# EAGLE design senseBox-CAM-M8Q_v21 (EAGLE 7.7.0)
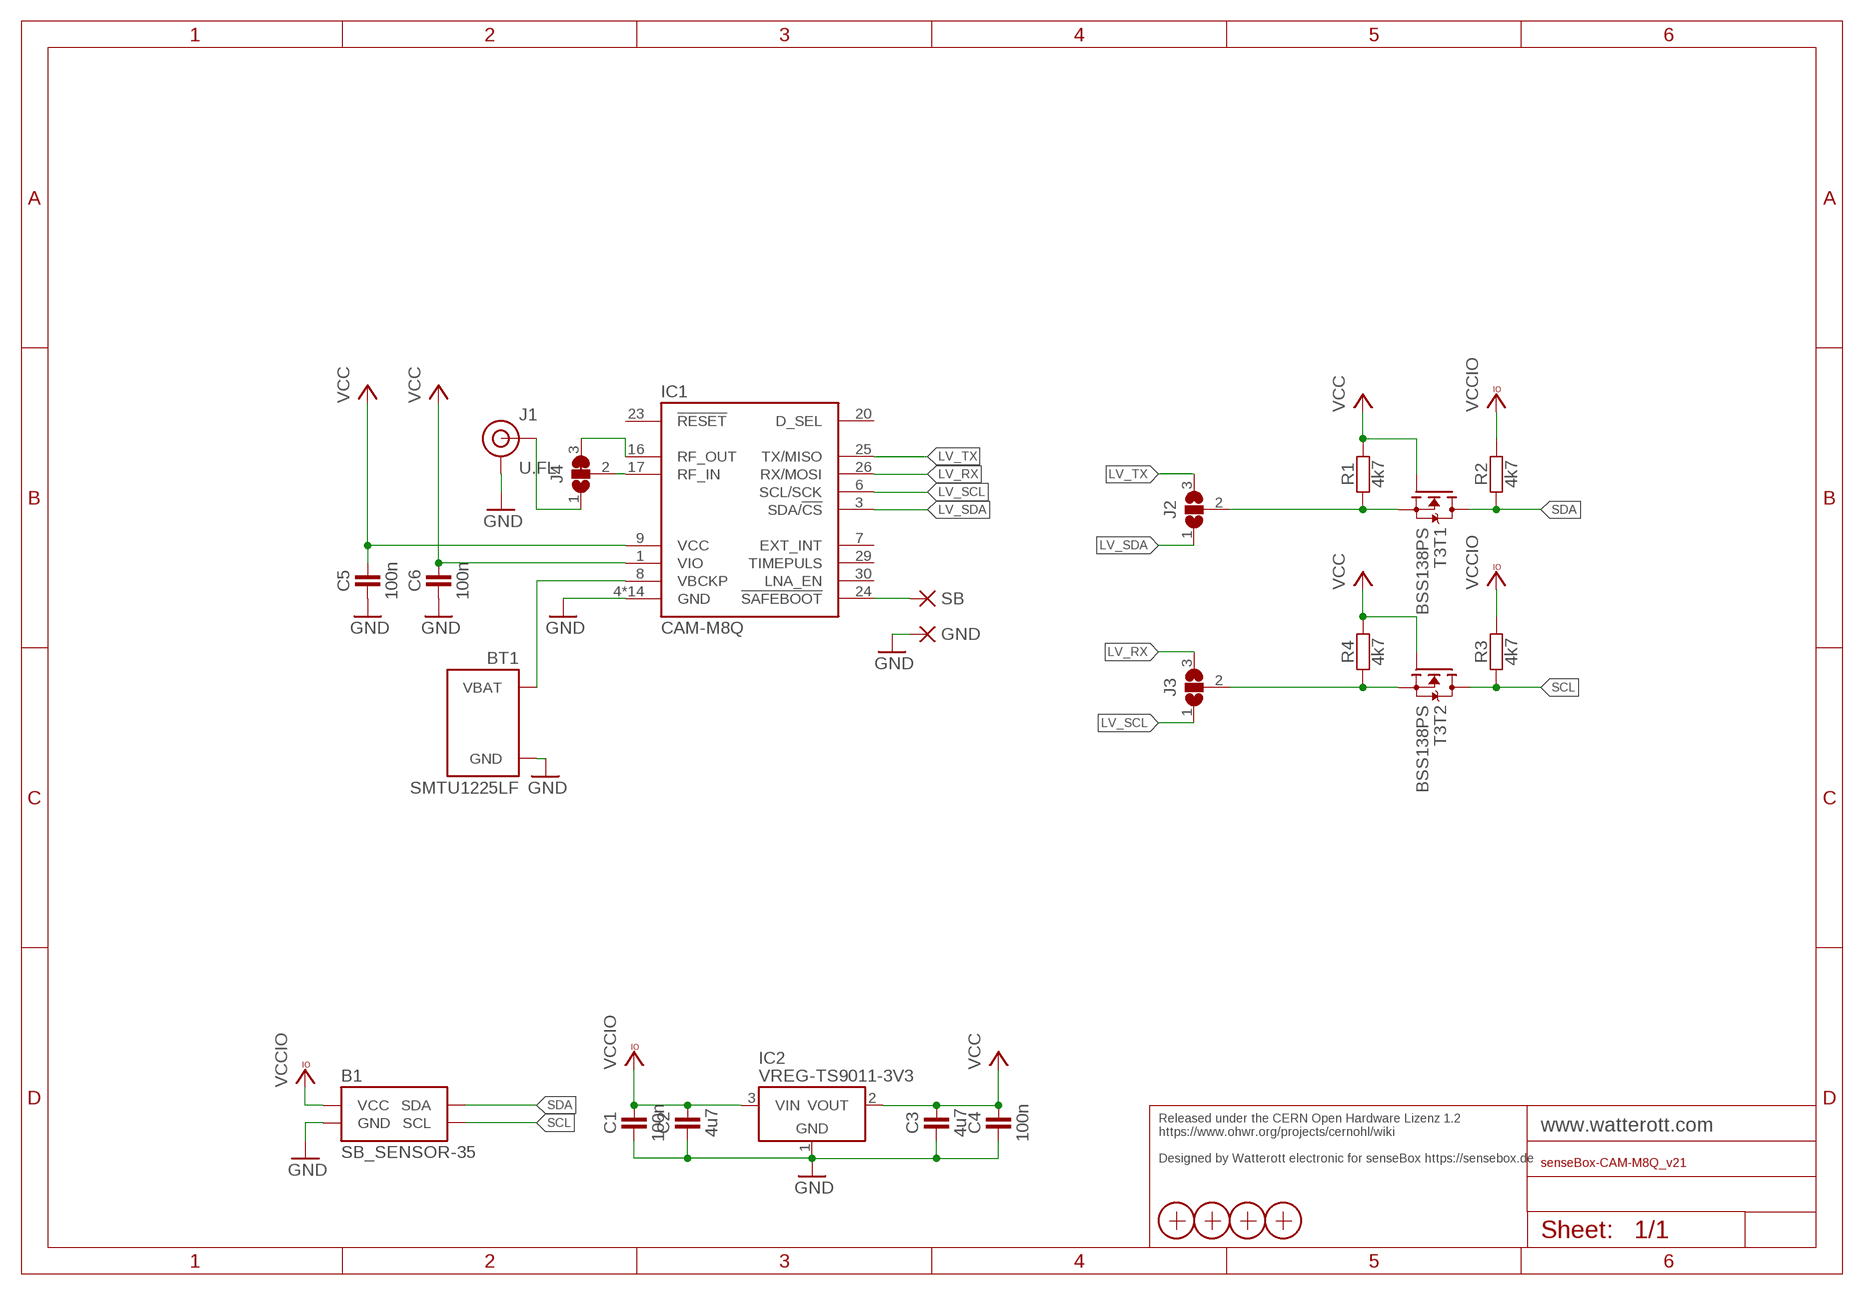
[diagram p0: schematic, sheet 1]

## Parts
B1  SB_SENSOR-35  [SB-35X25]
BT1  SMTU1225LF  BATTERY-SMTU1225LF  [BAT-SMTU1225LF]
C1  100n  CAPACITOR-0402  [C0402]
C2  4u7  CAPACITOR-0402  [C0402]
C3  4u7  CAPACITOR-0402  [C0402]
C4  100n  CAPACITOR-0402  [C0402]
C5  100n  CAPACITOR-0402  [C0402]
C6  100n  CAPACITOR-0402  [C0402]
GND  PAD-1.27X1.27_NC  [PAD-1.27X1.27_NC]
IC1  CAM-M8Q  [CAM-M8Q]
IC2  VREG-TS9011-3V3  [SOT23]
J1  U.FL  [U.FL]
J2  JUMPER3-0603-NC  [JUMPER3-0603_NC]
J3  JUMPER3-0603-NC  [JUMPER3-0603_NC]
J4  JUMPER3-0603  [JUMPER3-0603]
R1  4k7  RESISTOR-0402  [C0402]
R2  4k7  RESISTOR-0402  [C0402]
R3  4k7  RESISTOR-0402  [C0402]
R4  4k7  RESISTOR-0402  [C0402]
SB  PAD-1.27X1.27_NC  [PAD-1.27X1.27_NC]
T3  BSS138PS  [SOT363]
X1  PASSER-07  [PASSER_07MM]
X2  PASSER-07  [PASSER_07MM]
X3  PASSER-07  [PASSER_07MM]
X4  PASSER-07  [PASSER_07MM]

## Nets
GND: B1.GND BT1.-(GND) C1.1 C2.1 C3.1 C4.1 C5.1 C6.1 GND.1(P) IC1.4(GND) IC1.5(GND) IC1.10(GND) IC1.11(GND) IC1.12(GND) IC1.13(GND) IC1.14(GND) IC1.15(GND) IC1.18(GND) IC1.19(GND) IC1.21(GND) IC1.22(GND) IC1.27(GND) IC1.31(GND) IC2.1(GND) J1.1(GND) J1.2(GND)
LV_RX: IC1.26(RX/MOSI) J3.3
LV_SCL: IC1.6(SCL/SCK) J3.1
LV_SDA: IC1.3(SDA/!CS) J2.1
LV_TX: IC1.25(TX/MISO) J2.3
N$3: J2.2 R1.1 T3.1(T1:S)
N$4: J3.2 R4.1 T3.4(T2:S)
N$7: J1.FEED(SIGNAL) J4.1
RFIN: IC1.17(RF_IN) J4.2
RFOUT: IC1.16(RF_OUT) J4.3
SB: IC1.24(!SAFEBOOT) SB.1(P)
SCL: B1.SCL R3.1 T3.3(T2:D)
SDA: B1.SDA R2.1 T3.6(T1:D)
VBAT: BT1.+(VBAT) IC1.8(VBCKP)
VCC: C3.2 C4.2 C5.2 C6.2 IC1.1(VIO) IC1.9(VCC) IC2.2(VOUT) R1.2 R4.2 T3.2(T1:G) T3.5(T2:G)
VCCIO: B1.VCC C1.2 C2.2 IC2.3(VIN) R2.2 R3.2
Unconnected: IC1.7(EXT_INT) IC1.20(D_SEL) IC1.23(!RESET) IC1.29(TIMEPULS) IC1.30(LNA_EN)

## Notes on the sheet
- Released under the CERN Open Hardware Lizenz 1.2
  https://www.ohwr.org/projects/cernohl/wiki
  
  Designed by Watterott electronic for senseBox https://sensebox.de

## Library data of the parts
B1 = we-board:SB_SENSOR: SenseBox Sensors/Breakouts
BT1 = we-power:BATTERY: Battery Holder
C1-C6 = we-rcl:CAPACITOR: Capacitors ...2.2uF @ 6.3V -> 0402 ...4.7uF @ 6.3V -> 0603 ...10uF @ 16V -> 0805 ...22uF @ 25V -> 1206
GND SB = we-rcl:PAD: Pads and Test-Points
IC1 = we-sensor:CAM-M8Q: u-blox CAM-M8Q Multi-GNSS-Module (GPS, QZSS, GLONASS, Galileo, BeiDou)
IC2 = we-power:VREG: Voltage Regulators (LDOs, Switching Converters...) LDOs Taiwan Semi TS1117 800mA max 15V - compatible On Semi NCP1117 1A max 20V - compatible Diodes AP2111H 0.6A max 6V (0.25V@0.6A) - compatible Diodes AP2114H 1A max 6V (0.45V@1A) Taiwan Semi TS9011 250mA max 12V - compatible Diodes AP2210 300mA max 15V - compatible Microchip MCP1700 250mA max 6.5V - compatible Microchip MCP1702 250mA max 13V - compatible Microchip MCP1703 250mA max 16V - compatible Microchip MCP1754 150mA max 16V Taiwan Semi TS5204 150mA max 16V (low noise) DC/DC Converter Modules Recom R-78Ex.x-1.0-W36 1A max 28V - compatible CUI V78xx-2000 2A max 18V Murata OKI-78SR-x.x/1.5-W36 1.5A max 36V
J1 = we-con:U.FL: U.FL Connector
J2-J4 = we-rcl:JUMPER3: 3 Pin Jumpers
R1-R4 = we-rcl:RESISTOR: Resistors all kinds in 0402 and 0603
T3 = we-transistor:BSS138PS: Dual N-Channel MOSFET BSS138 (Vgs>=+/-20V, Vds>=40V, Id>=0.2A + Rds<=3Ohm @ Vgs=4.5V)
X1-X4 = we-symbol:PASSER: Fiducial Markers

## Board
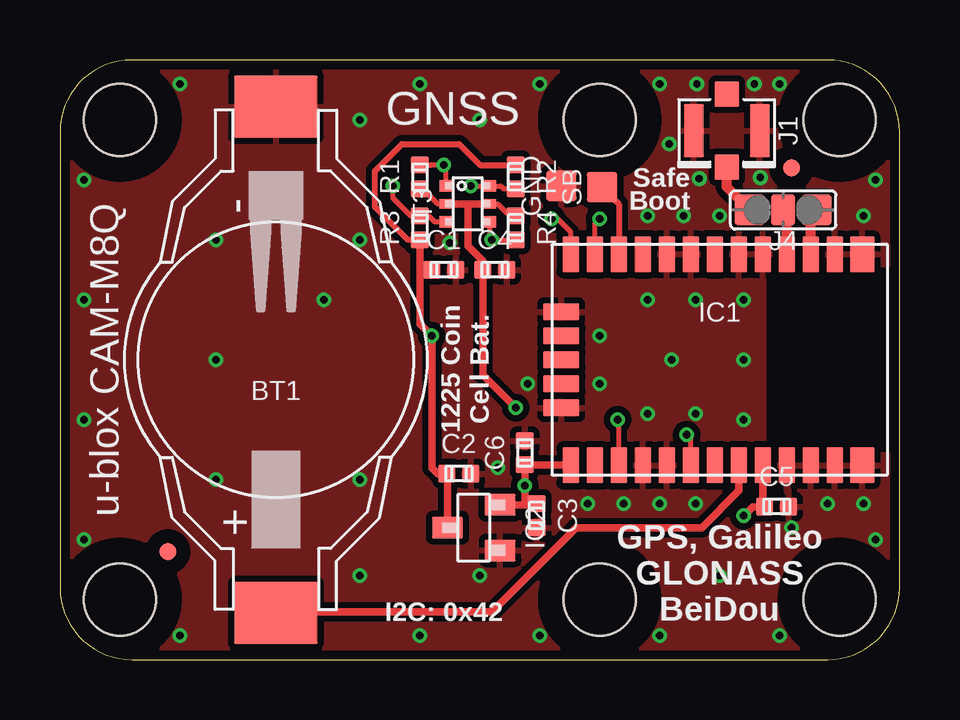
[diagram p1: board, top side]
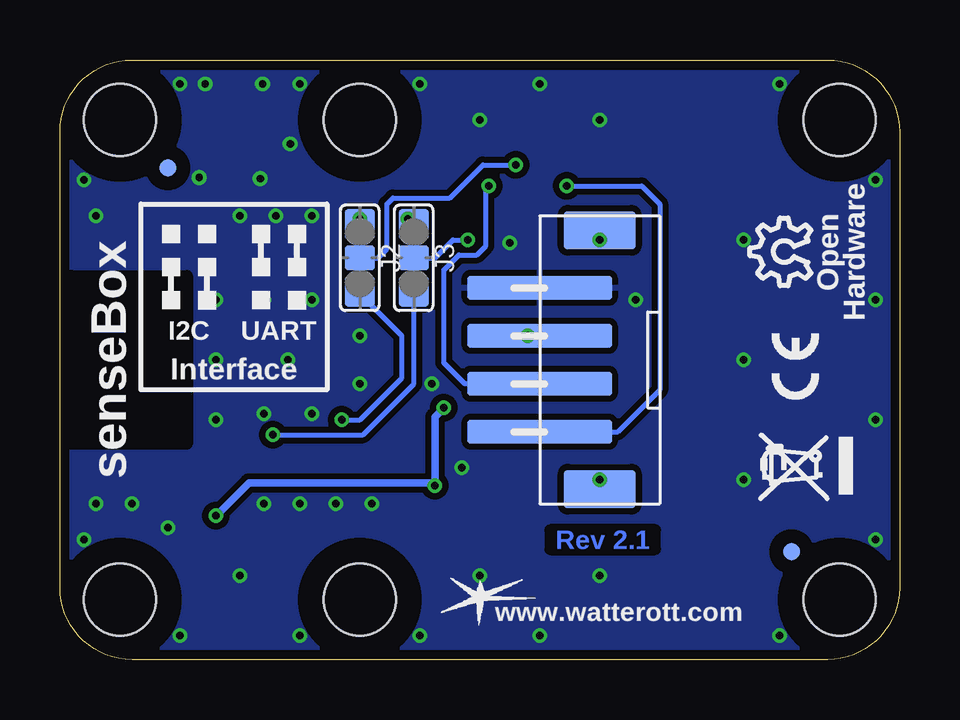
[diagram p2: board, bottom side, seen from below]

Size 35 x 25 mm. Coordinates in mm from the lower left corner, seen from the top.
Copper layers (1*16): Top 0.035mm / dielectric 1.5mm / Bottom 0.035mm
Design rules "we-dru-2-layer": minimum track width 0.15mm, minimum drill 0.3mm, track to track 0.15mm, track to pad 0.15mm, pad to pad 0.15mm, via to via 0.15mm, smd to smd 0.1mm, copper to edge 0.4mm, drill to drill 0.2mm, minimum pad ring 0.18mm, minimum via ring 0.16mm, stop-mask expansion 0.1mm, vias tented up to drill 0.5mm, thermal gap 0.25mm

### Footprints (pad centres in the part's own frame; a part is rotated, then mirrored left to right if it is on the bottom)
SB-35X25 = smd 6 x 1 bottom: GND 15,15.5; SCL 15,9.5; SDA 15,11.5; VCC 15,13.5 | smd 3 x 1.6 bottom: SHLD1 12.5,17.9; SHLD2 12.5,7.1 | hole 3: 2.5,22.5; 2.5,2.5; 22.5,22.5; 22.5,2.5; 32.5,22.5; 32.5,2.5
BAT-SMTU1225LF = smd 3.5 x 2.6: + 0,10.55; - 0,-10.55
C0402 = smd 0.75 x 0.7: 1 0,0.5; 2 0,-0.5
PAD-1.27X1.27_NC = smd 1.27 x 1.27: 1 0,0
CAM-M8Q = smd 0.7 x 1.5: 1 -6.2,-4.4; 2 -5.2,-4.4; 3 -4.2,-4.4; 4 -3.2,-4.4; 5 -2.2,-4.4; 6 -1.2,-4.4; 7 -0.2,-4.4; 8 0.8,-4.4; 9 1.8,-4.4; 10 2.8,-4.4; 11 3.8,-4.4; 12 4.8,-4.4; 15 4.8,4.4; 16 3.8,4.4; 17 2.8,4.4; 18 1.8,4.4; 19 0.8,4.4; 20 -0.2,4.4; 21 -1.2,4.4; 22 -2.2,4.4; 23 -3.2,4.4; 24 -4.2,4.4; 25 -5.2,4.4; 26 -6.2,4.4 | smd 1 x 1.5: 13 5.95,-4.4; 14 5.95,4.4 | smd 1.5 x 0.7: 27 -6.6,2; 28 -6.6,1; 29 -6.6,0; 30 -6.6,-1; 31 -6.6,-2
SOT23 = smd 1.3 x 0.9: 1 -1.1,0.95; 2 -1.1,-0.95; 3 1.1,0
U.FL = smd 2.2 x 0.85: 1 0,1.375; 2 0,-1.375 | smd 1.05 x 1: FEED 1.525,0; NC -1.525,0
JUMPER3-0603_NC = smd 1.25 x 1.25: 1 0,1.4; 3 0,-1.4 | smd 1.25 x 1: 2 0,0
JUMPER3-0603 = smd 1.25 x 1.25: 1 0,1.4; 3 0,-1.4 | smd 1.25 x 1: 2 0,0
SOT363 = smd 0.6 x 0.5: 1 -0.9,0.75; 3 -0.9,-0.75; 4 0.9,-0.75; 6 0.9,0.75 | smd 0.6 x 0.4: 2 -0.9,0; 5 0.9,0
PASSER_07MM = smd 0.7 x 0.7: X 0,0

### Placement (x,y rotation side)
B1  0,0 0 top
BT1  9,12.5 180 top
C1  16,16.25 270 top
C2  16.62,7.75 270 top
C3  19.88,6 180 top
C4  18.12,16.25 270 top
C5  29.88,6.38 270 top
C6  19.38,8.62 0 top
GND  20.9,19.75 0 top
IC1  27.5,12.5 0 top
IC2  17.25,5.5 180 top
J1  27.8,22.05 270 top
J2  22.5,16.75 180 bottom
J3  20.25,16.75 180 bottom
J4  30.15,18.75 90 top
R1  15,20.12 0 top
R2  19,20.12 180 top
R3  15,18 0 top
R4  19,18 180 top
SB  22.6,19.7 0 top
T3  17,19 0 top
X1  4.5,4.5 180 top
X2  30.5,20.5 180 top
X3  30.5,20.5 180 bottom
X4  4.5,4.5 180 bottom

### Tracks (layer width: path | path; a pad name or v marks a point on that pad's centre or on a via)
GND  (via drill 0.3)
  other vias: 25,6.5 30.5,5.5 32,6.5 33.5,6.5 27.5,18.5 28.95,24 26.55,24 29.2,20.1 33.5,18.5 5,1 20,1 15,1 30,1 25,1 1,5 1,10 1,15 1,20 5,24 15,24 20,24 25,24 30,24 34,5 34,20 26,18.5 28.5,15 28.5,12.5 28.5,10 23.5,6.5 22,6.5 12.5,17.5 12.5,7.5 26.5,15 26.5,10.25 24.5,18.5 24.5,10.25 24.5,15 22.5,13.5 22.5,11.5 26.5,6.5 25.5,12.5 6.5,12.5 12.5,3.5 17.5,3.5 17.5,22.5 16.25,17.38 12.5,22.5 26.65,20.05 6.5,7.5 6.5,17.5 11,15 18.25,8 27.5,3.5 25.4,21.5 19.5,11.5
  pour Top (isolate 0.254): 35,0 0,0 0,25 35,25
  pour Bottom (isolate 0.254): 35,0 0,0 0,25 35,25
LV_RX  (via drill 0.3)
  Top 0.203: IC1.26 21.3,17.82 20.75,18.38 v20.5,18.38
  Bottom 0.203: J3.3 20.27,18.15 v20.5,18.38
LV_SCL  (via drill 0.3)
  Top 0.203: IC1.6 26.3,9.2 v26.12,9.38
  Bottom 0.203: v26.12,9.38 22.38,9.38 20.25,11.5 J3.1
LV_SDA  (via drill 0.3)
  Top 0.203: IC1.3 23.3,9.95 v23.25,10
  Bottom 0.203: v23.25,10 22.5,10 20.75,11.75 20.75,13.5 22.5,15.25 J2.1
LV_TX  (via drill 0.3)
  Top 0.203: IC1.25 22.3,18.18 v22.5,18.38
  Bottom 0.203: v22.5,18.38 J2.3
N$3  (via drill 0.3)
  Top 0.203: 15.5,20.62 R1.1 v16,20.62 16.1,20.52 T3.1
  Bottom 0.203: J2.2 21.75,16.75 21.38,17.12 21.38,19 21.12,19.25 18.75,19.25 17.38,20.62 v16,20.62
N$4  (via drill 0.3)
  Top 0.203: R4.1 v18,17.5 17.9,17.6 T3.4
  Bottom 0.203: J3.2 19.38,16.75 18.62,17.5 v18,17.5
N$7
  Top 0.406: J4.1 27.8,19.7 J1.FEED
N$10
  Bottom 0.203: 20.25,15.5 20.25,16.5
N$11
  Bottom 0.203: 22.5,15.5 22.5,16.5
RFIN
  Top 0.406: IC1.17 30.3,18.6 J4.2
RFOUT
  Top 0.406: IC1.16 31.3,18.74 31.43,18.87 J4.3
SB
  Top 0.254: SB.1 23.3,19 IC1.24
SCL  (via drill 0.3)
  Top 0.203: 16.12,18.23 T3.3 15.62,18.25 15.38,18.5 R3.1 14.62,18.5 13.88,19.25 v13.88,19.75
  Bottom 0.203: B1.SCL 11.75,9.5 10,11.25 10,19 10.75,19.75 v13.88,19.75
SDA  (via drill 0.3)
  Top 0.203: R2.1 18.5,19.62 18.38,19.75 T3.6 v17.12,19.75
  Bottom 0.203: v17.12,19.75 17.25,19.62 17.25,17.25 17.62,16.88 18.38,16.88 19,16.25 19,12.38 18.12,11.5 B1.SDA
VBAT
  Top 0.203: 9.05,2 BT1.+
  Top 0.305: IC1.8 28.3,7.05 26.75,5.5 21.5,5.5 18,2 9.05,2
VCC  (via drill 0.3)
  Top 0.203: T3.2 15.75,19 15.12,19.62 R1.2 | T3.5 18.25,19 18.75,18.5 R4.2 | 21.27,8.12 IC1.1 | 19.82,6.45 C3.2
  Top 0.305: IC2.2 19.38,6.45 | 19.38,6.45 v19.38,7.25 C6.2 21.27,8.12 | T3.2 17,19 | 17,19 T3.5 | 17,19 17,17.25 17.62,16.62 C4.2 17.62,11.88 v19,10.5 | 19.38,6.45 19.82,6.45 | v28.5,6 28.88,6.38 C5.2 29.3,6.45 IC1.9
  Bottom 0.305: v28.5,6 27.12,7.38 19.38,7.38 v19.38,7.25 19.38,10.12 v19,10.5
VCCIO  (via drill 0.3)
  Top 0.203: 16.15,7.72 C2.2
  Top 0.254: R3.2 14.5,17.5 13.12,18.88 13.12,20.38 14.25,21.5 16.62,21.5 17.5,20.62 R2.2
  Top 0.305: R3.2 15,16.25 | 15,16.25 15,14 v15.5,13.5 15.5,8 15.75,7.75 C2.2 | C1.2 15,16.25 | IC2.3 16.15,7.72
  Bottom 0.203: v15.5,13.5 B1.VCC

### Text on the board
Bottom: Rev 2.1
tPlace: GNSS | Safe / Boot | u-blox CAM-M8Q | 1225 Coin / Cell Bat. | GPS, Galileo / GLONASS / BeiDou | I2C: 0x42
bPlace: UART | I2C | Interface
Reference: Silkscreen: 21 tPlace + 22 bPlace